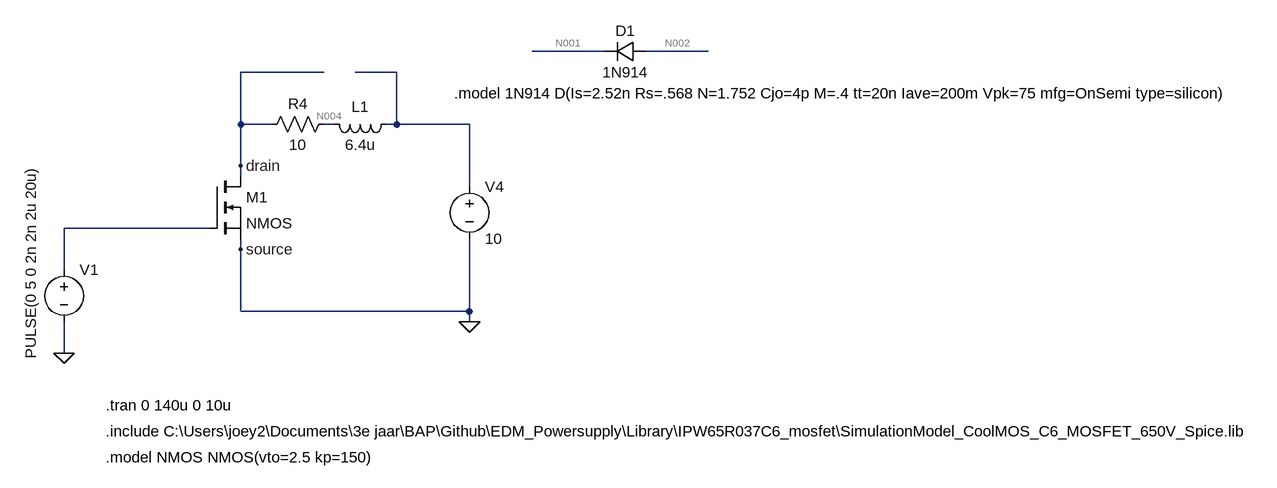
[diagram p0: schematic EDM_Powersupply_Lpara.asc]
EDM_Powersupply_Lpara.asc, the LTspice schematic file:
Version 4
SHEET 1 1668 680
WIRE 1184 -144 1072 -144
WIRE 1344 -144 1248 -144
WIRE 752 -112 624 -112
WIRE 864 -112 800 -112
WIRE 624 -32 624 -112
WIRE 672 -32 624 -32
WIRE 768 -32 752 -32
WIRE 864 -32 864 -112
WIRE 864 -32 848 -32
WIRE 976 -32 864 -32
WIRE 624 32 624 -32
WIRE 624 48 624 32
WIRE 976 64 976 -32
WIRE 576 128 352 128
WIRE 624 160 624 144
WIRE 352 192 352 128
WIRE 624 256 624 160
WIRE 976 256 976 144
WIRE 976 256 624 256
WIRE 976 272 976 256
WIRE 352 320 352 272
FLAG 352 320 0
FLAG 624 32 drain
FLAG 624 160 source
FLAG 976 272 0
SYMBOL voltage 352 176 R0
WINDOW 123 0 0 Left 0
WINDOW 39 0 0 Left 0
WINDOW 3 -51 153 VLeft 2
SYMATTR Value PULSE(0 5 0 2n 2n 2u 20u)
SYMATTR InstName V1
SYMBOL res 656 -16 R270
WINDOW 0 32 56 VTop 2
WINDOW 3 0 56 VBottom 2
SYMATTR InstName R4
SYMATTR Value 10
SYMBOL voltage 976 48 R0
WINDOW 123 0 0 Left 0
WINDOW 39 0 0 Left 0
SYMATTR InstName V4
SYMATTR Value 10
SYMBOL nmos 576 48 R0
SYMATTR InstName M1
SYMBOL ind 864 -48 R90
WINDOW 0 5 56 VBottom 2
WINDOW 3 32 56 VTop 2
SYMATTR InstName L1
SYMATTR Value 6.4u
SYMBOL diode 1248 -160 R90
WINDOW 0 0 32 VBottom 2
WINDOW 3 32 32 VTop 2
SYMATTR InstName D1
SYMATTR Value 1N914
TEXT 416 440 Left 2 !.include C:\\Users\\joey2\\Documents\\3e jaar\\BAP\\Github\\EDM_Powersupply\\Library\\IPW65R037C6_mosfet\\SimulationModel_CoolMOS_C6_MOSFET_650V_Spice.lib
TEXT 416 400 Left 2 !.tran 0 140u 0 10u
TEXT 952 -80 Left 2 !.model 1N914 D(Is=2.52n Rs=.568 N=1.752 Cjo=4p M=.4 tt=20n Iave=200m Vpk=75 mfg=OnSemi type=silicon)
TEXT 416 480 Left 2 !.model NMOS NMOS(vto=2.5 kp=150)

The netlist it stands for:
* EDM_Powersupply_Lpara.asc
V1 N005 0 PULSE(0 5 0 2n 2n 2u 20u)
R4 drain N004 10
V4 N003 0 10
M1 drain N005 0 0 NMOS
L1 N003 N004 6.4u
D1 N002 N001 1N914
.model D D
.lib standard.dio
.model NMOS NMOS
.model PMOS PMOS
.lib standard.mos
.include C:\Users\joey2\Documents\3e jaar\BAP\Github\EDM_Powersupply\Library\IPW65R037C6_mosfet\SimulationModel_CoolMOS_C6_MOSFET_650V_Spice.lib
.tran 0 140u 0 10u
.model 1N914 D(Is=2.52n Rs=.568 N=1.752 Cjo=4p M=.4 tt=20n Iave=200m Vpk=75 mfg=OnSemi type=silicon)
.model NMOS NMOS(vto=2.5 kp=150)
.backanno
.end

* Results of the author's LTspice run, read from the files saved beside the schematic
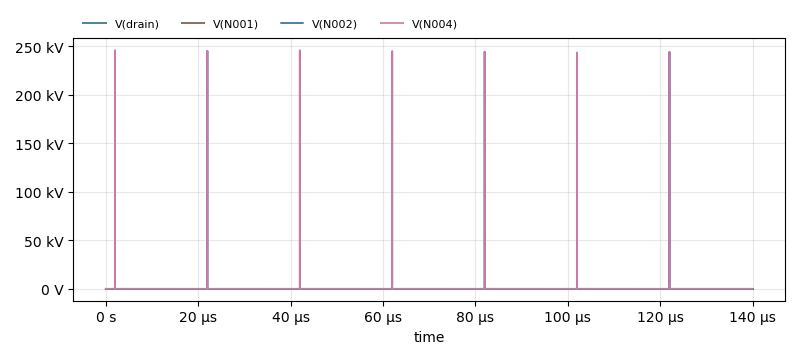
[diagram p1: Transient Analysis of EDM_Powersupply_Lpara.asc, plotted from the saved traces]
* Transient Analysis, 1 run:
*   V(drain): min 0 V, max 245.6 kV, average 9.303 V, rms 232.5 V, last 10 V
*   V(N001): min -0.07779 fV, max 0.1642 fV, average -2.081e-06 fV, rms 2.511e-05 fV, last -0.0001003 fV
*   V(N002): min -0.2882 fV, max 1.126 fV, average 0.02942 fV, rms 0.2302 fV, last 1.126 fV
*   V(N004): min 0 V, max 245.6 kV, average 9.988 V, rms 232.5 V, last 10 V